# Altium project Soldeerbout.PrjPcb
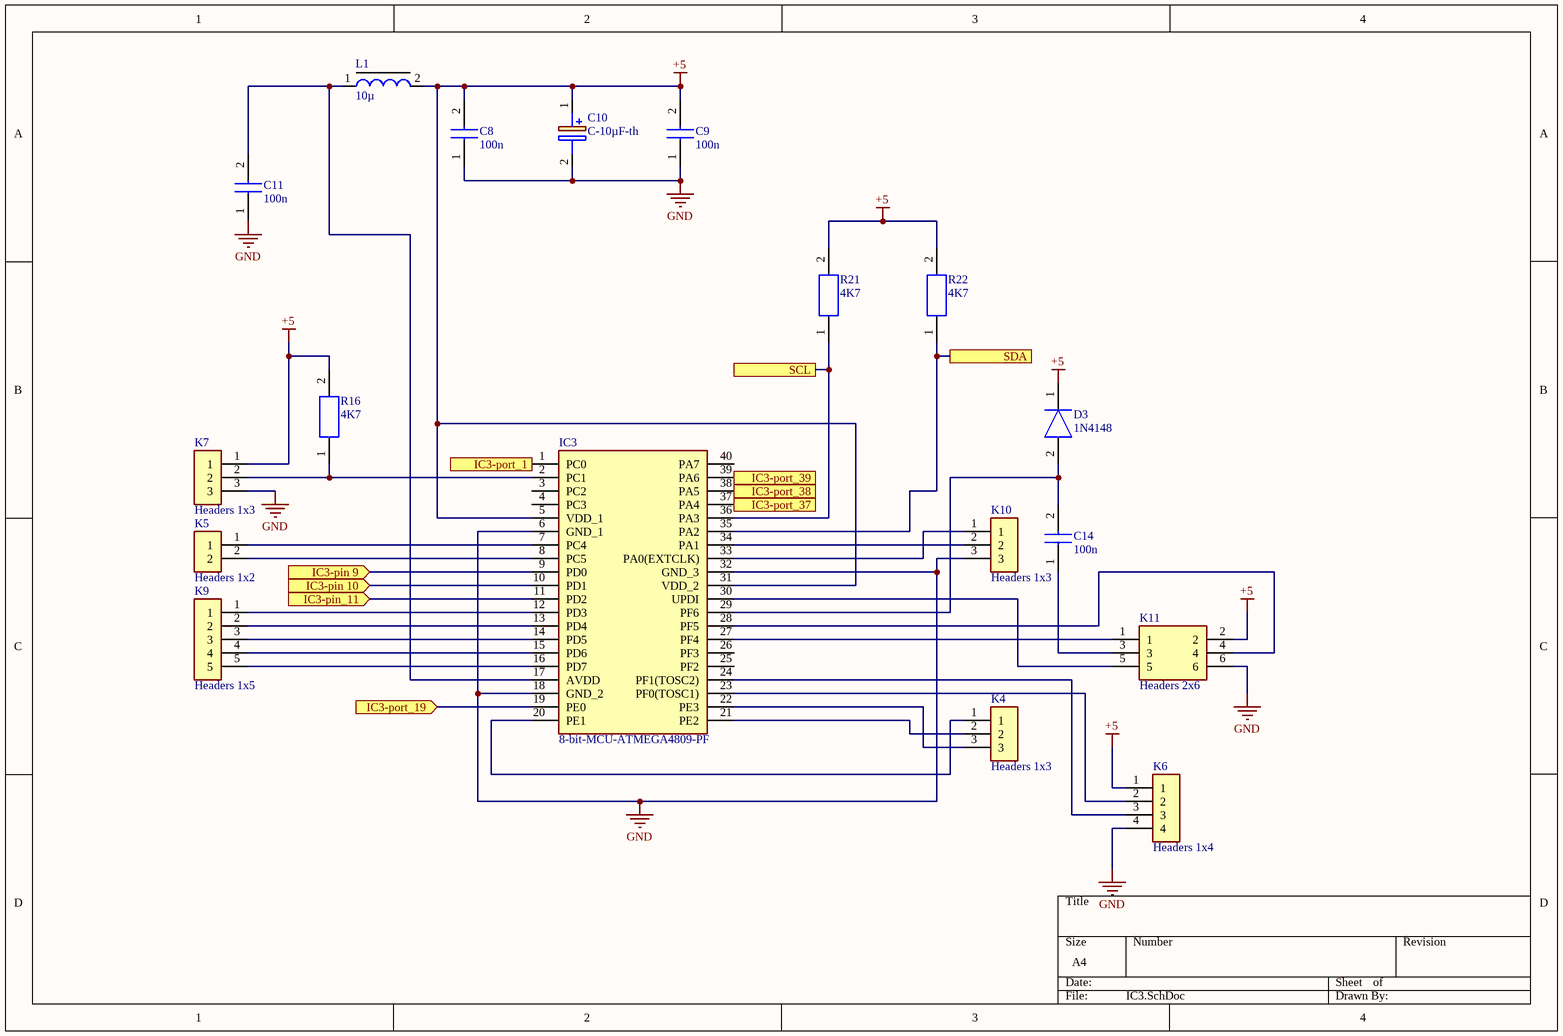
[diagram p0: IC3.SchDoc]
7 sheets, 78 parts. Net scope: flat (ports and power ports of the same name join across sheets).
Sheets:
  IC3.SchDoc
  Omvorming.SchDoc
  Opamps.SchDoc
  mosfet.SchDoc
  display.SchDoc
  encoder.SchDoc
  7-segment.SchDoc

## Sheet IC3.SchDoc
size A4; Engineer: Altium Designer; Organization: PXL; SheetNumber: 1; SheetTotal: 7

### Parts
C8  100n  [C-0805-smd]
C9  100n  [C-0805-smd]
C10  C-10µF-th  [C-10µF-th]
C11  100n  [C-0805-smd]
C14  100n  [C-0805-smd]
D3  1N4148  [1N4148]
IC3  8-bit-MCU-ATMEGA4809-PF  [8-bit-MCU-ATMEGA4809-PF]
K4  Headers 1x3  [Headers 1x3]
K5  Headers 1x2  [Headers 1x2]
K6  Headers 1x4  [Headers 1x4]
K7  Headers 1x3  [Headers 1x3]
K9  Headers 1x5  [Headers 1x5]
K10  Headers 1x3  [Headers 1x3]
K11  Headers 2x6  [Headers 2x6]
L1  10µ  [Smorespoel-10µH-130mA]
R16  4K7  [R-0805]
R21  4K7  [R-0805]
R22  4K7  [R-0805]

### Ports
IC3-pin 9 (in), IC3-pin 10 (in), IC3-pin_11 (in), IC3-port_1, IC3-port_19 (in), IC3-port_37, IC3-port_38, IC3-port_39, SCL, SDA

### Nets
+5: C8.2 C9.2 C10.1(+) D3.1(K) IC3.5(VDD_1) IC3.31(VDD_2) K6.1 K7.1 K11.2 L1.2 R16.2 R21.2 R22.2
GND: C8.1 C9.1 C10.2(-) C11.1 IC3.6(GND_1) IC3.18(GND_2) IC3.32(GND_3) K6.4 K7.3 K10.3 K11.6
NetC03_1: IC3.38(PA5) ; port IC3-port_38
NetC04_1: IC3.39(PA6) ; port IC3-port_39
NetC05_1: IC3.37(PA4) ; port IC3-port_37
NetC6_2: IC3.9(PD0) ; port IC3-pin 9
NetC11_2: C11.2 IC3.17(AVDD) L1.1
NetC12_2: IC3.10(PD1) ; port IC3-pin 10
NetC14_1: C14.1 K11.3
NetC14_2: C14.2 D3.2(A) IC3.29(PF6)
NetD2_1: IC3.11(PD2) ; port IC3-pin_11
NetIC3_1: IC3.1(PC0) ; port IC3-port_1
NetIC3_2: IC3.2(PC1) K7.2 R16.1
NetIC3_7: IC3.7(PC4) K5.1
NetIC3_8: IC3.8(PC5) K5.2
NetIC3_12: IC3.12(PD3) K9.1
NetIC3_13: IC3.13(PD4) K9.2
NetIC3_14: IC3.14(PD5) K9.3
NetIC3_15: IC3.15(PD6) K9.4
NetIC3_16: IC3.16(PD7) K9.5
NetIC3_19: IC3.19(PE0) ; port IC3-port_19
NetIC3_20: IC3.20(PE1) K4.1
NetIC3_21: IC3.21(PE2) K4.2
NetIC3_22: IC3.22(PE3) K4.3
NetIC3_23: IC3.23(PF0(TOSC1)) K6.2
NetIC3_24: IC3.24(PF1(TOSC2)) K6.3
NetIC3_27: IC3.27(PF4) K11.1
NetIC3_28: IC3.28(PF5) K11.4
NetIC3_30: IC3.30(UPDI) K11.5
NetIC3_33: IC3.33(PA0(EXTCLK)) K10.1
NetIC3_34: IC3.34(PA1) K10.2
NetIC3_35: IC3.35(PA2) R22.1 ; port SDA
NetIC3_36: IC3.36(PA3) R21.1 ; port SCL

Not connected (* = marked no-connect by the designer): IC3 3(PC2) 4(PC3) 25(PF2) 26(PF3) 40(PA7)

### Library data of the parts
C8 C9 C11 C14 = C-0805-smd: Capacitor; Manufacturer_Name: Kemet; Manufacturer_Part_Number: C0805C301G5GACTU; Datasheet Link: https://connect.kemet.com:7667/gateway/IntelliData-ComponentDocumentation/1.0/download/specsheet/C0805C301G5GACTU; Height: 0.88mm
C10 = C-10µF-th: Capacitor Polarised; Manufacturer_Name: Panasonic; Manufacturer_Part_Number: ECA-1HM100I; Datasheet Link: https://componentsearchengine.com//ECA-1HM100I.pdf; Height: 12mm; Mouser2 Part Number: 667-ECA-1HM100I; Mouser2 Price/Stock: https://www.mouser.com/Search/Refine.aspx?Keyword=667-ECA-1HM100I
D3 = 1N4148: Diode; Manufacturer_Name: Nexperia; Datasheet Link: https://datasheet.datasheetarchive.com/originals/distributors/Datasheets-112/DSAP0040891.pdf; Manufacturer_Part_Number: 1N4148
IC3 = 8-bit-MCU-ATMEGA4809-PF: Integrated Circuit; Manufacturer_Name: Microchip; Datasheet Link: https://componentsearchengine.com//ATMEGA4809-PF.pdf; Height: 6.35mm; Mouser2 Part Number: 556-ATMEGA4809-PF; Mouser2 Price/Stock: https://www.mouser.com/Search/Refine.aspx?Keyword=556-ATMEGA4809-PF; Manufacturer_Part_Number: ATMEGA4809-PF
K4 K7 K10 = Headers 1x3: Connector; Manufacturer_Name: TE Connectivity; Manufacturer_Part_Number: 2-826646-0; Datasheet Link: https://componentsearchengine.com/Datasheets/1/2-826646-0.pdf; Height: 8.8mm
K5 = Headers 1x2: Connector; Manufacturer_Name: TE Connectivity; Manufacturer_Part_Number: 2-826646-0; Datasheet Link: https://componentsearchengine.com/Datasheets/1/2-826646-0.pdf; Height: 8.8mm
K6 = Headers 1x4: Connector; Manufacturer_Name: TE Connectivity; Manufacturer_Part_Number: 2-826646-0; Datasheet Link: https://componentsearchengine.com/Datasheets/1/2-826646-0.pdf; Height: 8.8mm
K9 = Headers 1x5: Connector; Manufacturer_Name: TE Connectivity; Manufacturer_Part_Number: 2-826646-0; Datasheet Link: https://componentsearchengine.com/Datasheets/1/2-826646-0.pdf; Height: 8.8mm
K11 = Headers 2x6: Connector; Manufacturer_Name: Harwin; Manufacturer_Part_Number: M20-9761042; Datasheet Link: https://componentsearchengine.com//M20-9761042.pdf; Height: 8.38mm; Mouser2 Part Number: 855-M20-9761042; Mouser2 Price/Stock: https://www.mouser.com/Search/Refine.aspx?Keyword=855-M20-9761042
L1 = Smorespoel-10µH-130mA: THT Common Mode Power Line Choke WE-CMB, L = 1.00 mH; Inductance: 1.00 mH; PackageDescription: THT Inductor, 4-Leads, Body 27.5 x 18.5 mm; PackageReference: WE-CMB-L; PackageVersion: 2004; ComponentLink2URL: http://www.we-online.de/katalog/media/pdf/744824101.pdf; ComponentLink2Description: Datasheet; ComponentLink1Description: Manufacturer Link; DatasheetVersion: ver 5, Oct-2004; ComponentLink1URL: http://www.we-online.com
R16 R21 R22 = R-0805: Resistor; Manufacturer_Name: Vishay; Manufacturer_Part_Number: TNPU0805500RAZEN00; Height: 0.55mm

## Sheet Omvorming.SchDoc
size A4; SheetNumber: 2; SheetTotal: 7
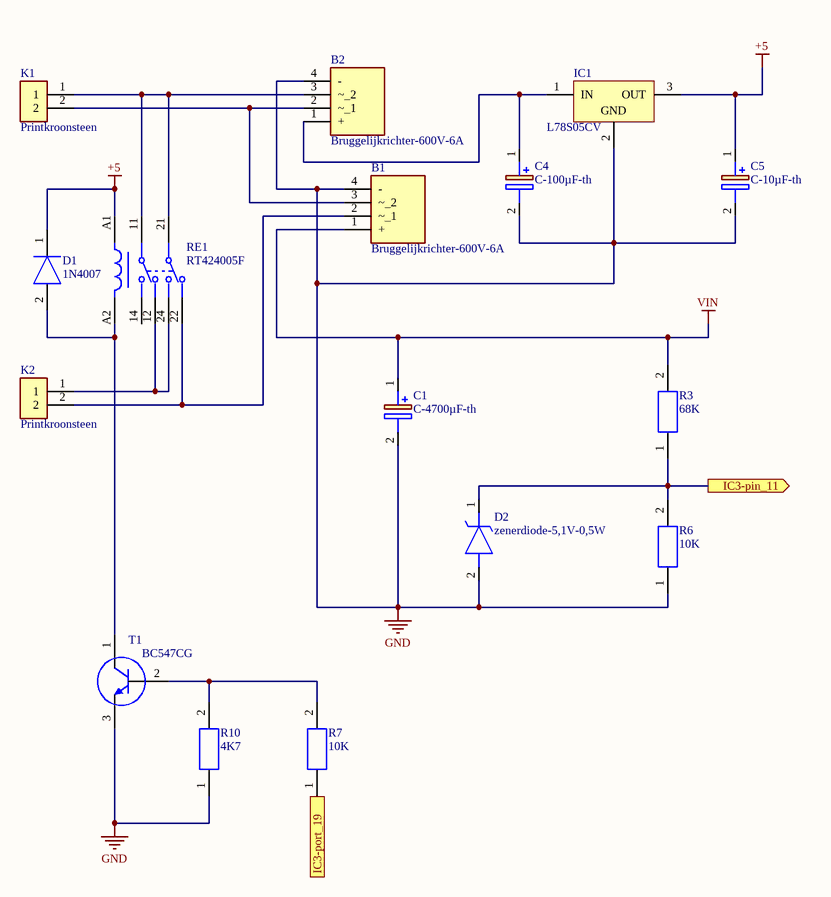
[diagram p1: Omvorming.SchDoc]

### Parts
B1  Bruggelijkrichter-600V-6A  [Bruggelijkrichter-600V-6A]
B2  Bruggelijkrichter-600V-6A  [Bruggelijkrichter-600V-6A]
C1  C-4700µF-th  [C-4700µF-th]
C4  C-100µF-th  [C-100µF-th]
C5  C-10µF-th  [C-10µF-th]
D1  1N4007  [1N4007]
D2  zenerdiode-5,1V-0,5W  [zenerdiode-5,1V-0,5W]
IC1  L78S05CV  [5V_Regulator-2A]
K1  Printkroonsteen  [Printkroonsteen]
K2  Printkroonsteen  [Printkroonsteen]
R3  68K  [R-0805]
R6  10K  [R-0805]
R7  10K  [R-0805]
R10  4K7  [R-0805]
RE1  RT424005F  [vermogenrelais-5VDC-8A]
T1  BC547CG  [BC547C]

### Ports
IC3-pin_11 (out), IC3-port_19 (out)

### Nets
+5: C5.1(+) D1.1(K) IC1.3(OUT) RE1.A1
GND: B1.4(-) B2.4(-) C1.2(-) C4.2(-) C5.2(-) D2.2(A) IC1.2(GND) R6.1 R10.1 T1.3(E)
VIN: B1.1(+) C1.1(+) R3.2
NetB1_2: B1.2(~_1) K2.2 RE1.22
NetB1_3: B1.3(~_2) B2.2(~_1) K1.2
NetB2_1: B2.1(+) C4.1(+) IC1.1(IN)
NetB2_3: B2.3(~_2) K1.1 RE1.11 RE1.21
NetD1_2: D1.2(A) RE1.A2 T1.1(C)
NetD2_1: D2.1(K) R3.1 R6.2 ; port IC3-pin_11
NetIC3_19: R7.1 ; port IC3-port_19
NetK2_1: K2.1 RE1.12 RE1.24
NetR7_2: R7.2 R10.2 T1.2(B)

Not connected (* = marked no-connect by the designer): RE1 14

### Library data of the parts
B1 B2 = Bruggelijkrichter-600V-6A: Bridge Rectifier; Manufacturer_Name: Vishay; Manufacturer_Part_Number: GBU6J-E3/45; Datasheet Link: http://www.vishay.com/docs/88615/gbu6a.pdf; Height: 18.8mm
C1 = C-4700µF-th: Capacitor Polarised; Manufacturer_Name: Kemet; Manufacturer_Part_Number: ESK478M050AQ3AA; Datasheet Link: https://componentsearchengine.com//ESK478M050AQ3AA.pdf; Height: 37mm; Mouser2 Part Number: 80-ESK478M050AQ3AA; Mouser2 Price/Stock: https://www.mouser.com/Search/Refine.aspx?Keyword=80-ESK478M050AQ3AA
C4 = C-100µF-th: Capacitor Polarised; Manufacturer_Name: Kemet; Manufacturer_Part_Number: ESK107M050AG3EA; Height: 12.5mm
C5 = C-10µF-th: as C10 on sheet IC3; Datasheet Link: https://componentsearchengine.com//ECA-1HM100I.pdf; Height: 12mm; Mouser2 Part Number: 667-ECA-1HM100I; Mouser2 Price/Stock: https://www.mouser.com/Search/Refine.aspx?Keyword=667-ECA-1HM100I
D1 = 1N4007: Diode; Manufacturer_Name: Rectron; Manufacturer_Part_Number: 1N4007-T; Datasheet Link: https://componentsearchengine.com//1N4007-T.pdf; Mouser2 Part Number: 583-1N4007-T; Mouser2 Price/Stock: https://www.mouser.com/Search/Refine.aspx?Keyword=583-1N4007-T
D2 = zenerdiode-5,1V-0,5W: Zener Diode; Manufacturer_Name: ON Semiconductor; Manufacturer_Part_Number: MM5Z4689T1G; Datasheet Link: https://www.mouser.in/datasheet/2/308/1/MM5Z4678T1_D-2315920.pdf; Height: 0.7mm
IC1 = 5V_Regulator-2A: 2A Positive Voltage Regulator, 5V, 3-Pin TO-220; PackageVersion: ver3.0; ComponentLink2URL: http://www.st.com/internet/com/TECHNICAL_RESOURCES/TECHNICAL_LITERATURE/DATASHEET/CD00000449.pdf; ComponentLink1Description: Manufacturer URL; DatasheetVersion: 1/03/2010; PackageDescription: TO, Thru-Hole, Vertical, Heatsink Mounted; 3 In-Line Leads; Pitch 2.54 mm; ComponentLink2Description: Datasheet; ComponentLink1URL: http://www.st.com; ComponentLink3Description: Package Specification; PackageReference: TO220; ComponentLink3URL: http://www.st.com/internet/com/TECHNICAL_RESOURCES/TECHNICAL_LITERATURE/PACKAGE_INFORMATION/CD00004649.pdf
K1 K2 = Printkroonsteen: Connector; Manufacturer_Name: CUI Inc.; Manufacturer_Part_Number: TB007-508-02BE; Datasheet Link: https://componentsearchengine.com//TB007-508-02BE.pdf; Height: 14mm; Mouser2 Part Number: 490-TB007-508-02BE; Mouser2 Price/Stock: https://www.mouser.com/Search/Refine.aspx?Keyword=490-TB007-508-02BE
R3 R6 R7 R10 = R-0805: as R16 on sheet IC3; Height: 0.55mm
RE1 = vermogenrelais-5VDC-8A: RELAY GENERAL PURPOSE DPDT 8A 5V; Power Consumption: 400mW; Coil Current: 80.6mA; Max Voltage Rating (AC): 400V; Coil Power: 500mW; Dropout Voltage: 500mV; Operate Time: 7ms; Contact Voltage Rating (AC): 250V; Coil Type: Non-Latching; Coil Resistance: 62R; Release Time: 3ms; Max Operating Temperature: 85°C; Package Quantity: 5000; Relay Type: General Purpose; Series: RT2; Lead Free: Lead Free; Coil Voltage (DC): 5V; Contact Current Rating: 8A; Packaging: Carton; Height: 15.7mm; Mount: Through Hole; Width: 12.7mm; ELV: Compliant; Termination: PCB; Contact Material: Silver; Throw Configuration: DPDT; Min Operating Temperature: -40°C; Weight: 13g; RoHS Compliant: Yes; Length: 29mm; Radiation Hardening: No
T1 = BC547C: Amplifier Transistor, NPN Silicon, 3-Pin TO-92, Pb-Free, Bulk Box; Manufacturer: On Semiconductor; IC Continuous (A): 0.1; fT Min (MHz): 150; ComponentLink3URL: http://www.onsemi.cn/pub_link/Collateral/2N6426-D.PDF; Mounting Technology: Through Hole; PackageReference: TO-92-3-29-11_AM_SL; ComponentLink2Description: Datasheet; RoHS: TRUE; Packing: Bulk Box; ComponentLink1Description: Manufacturer URL; PackageDescription: 3-Pin Transistor Outline, Body 4.825 x 3.685 mm, Pitch 1.27 mm; PackageVersion: Rev. AM; ComponentLink2URL: http://www.onsemi.com/pub_link/Collateral/BC546-D.PDF; ComponentLink3Description: Package Specification; ComponentLink1URL: http://www.onsemi.com/; DatasheetVersion: Rev. 7; Polarity: NPN; PartNumber: BC547CG

## Sheet Opamps.SchDoc
size A4; SheetNumber: 3; SheetTotal: 7
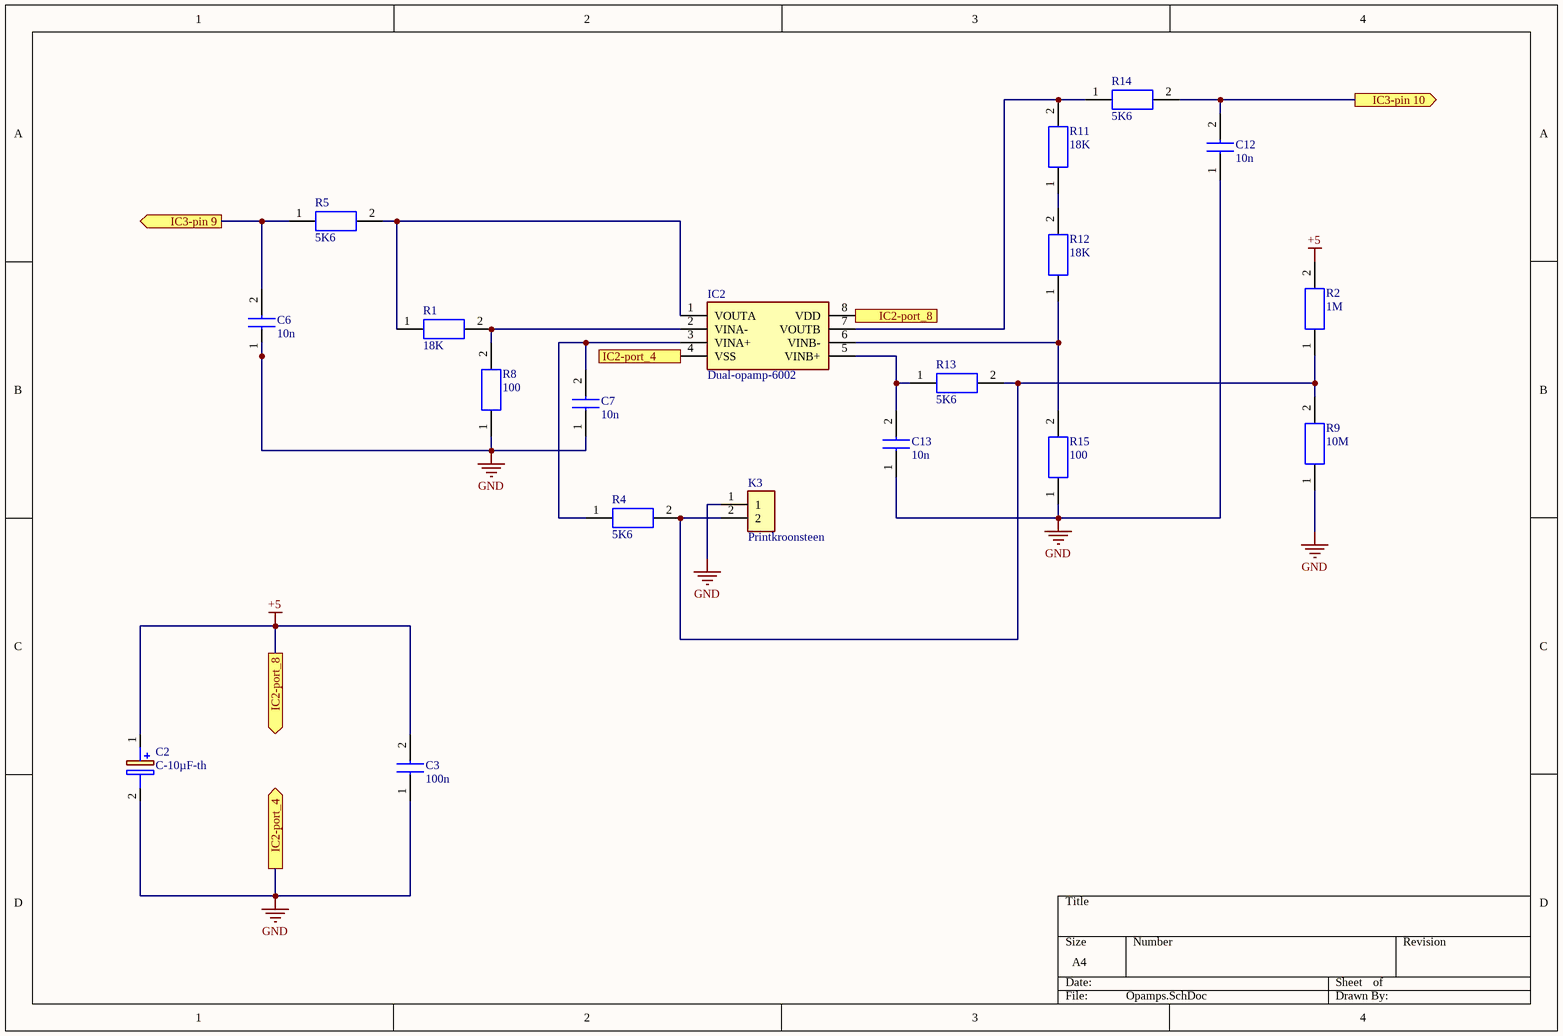
[diagram p2: Opamps.SchDoc]

### Parts
C2  C-10µF-th  [C-10µF-th]
C3  100n  [C-0805-smd]
C6  10n  [C-0805-smd]
C7  10n  [C-0805-smd]
C12  10n  [C-0805-smd]
C13  10n  [C-0805-smd]
IC2  Dual-opamp-6002  [Dual-opamp-6002]
K3  Printkroonsteen  [Printkroonsteen]
R1  18K  [R-0805]
R2  1M  [R-0805]
R4  5K6  [R-0805]
R5  5K6  [R-0805]
R8  100  [R-0805]
R9  10M  [R-0805]
R11  18K  [R-0805]
R12  18K  [R-0805]
R13  5K6  [R-0805]
R14  5K6  [R-0805]
R15  100  [R-0805]

### Ports
IC2-port_4 (in), IC2-port_4 (out), IC2-port_8 (in), IC2-port_8 (out), IC3-pin 9 (out), IC3-pin 10 (out)

### Nets
+5: C2.1(+) C3.2 IC2.8(VDD) R2.2 ; port IC2-port_8
GND: C2.2(-) C3.1 C6.1 C7.1 C12.1 C13.1 IC2.4(VSS) K3.1 R8.1 R9.1 R15.1 ; port IC2-port_4
NetC6_2: C6.2 R5.1 ; port IC3-pin 9
NetC7_2: C7.2 IC2.3(VINA+) R4.1
NetC12_2: C12.2 R14.2 ; port IC3-pin 10
NetC13_2: C13.2 IC2.5(VINB+) R13.1
NetIC2_1: IC2.1(VOUTA) R1.1 R5.2
NetIC2_2: IC2.2(VINA-) R1.2 R8.2
NetIC2_6: IC2.6(VINB-) R12.1 R15.2
NetIC2_7: IC2.7(VOUTB) R11.2 R14.1
NetK3_2: K3.2 R2.1 R4.2 R9.2 R13.2
NetR11_1: R11.1 R12.2

### Library data of the parts
C2 = C-10µF-th: as C10 on sheet IC3; Datasheet Link: https://componentsearchengine.com//ECA-1HM100I.pdf; Height: 12mm; Mouser2 Part Number: 667-ECA-1HM100I; Mouser2 Price/Stock: https://www.mouser.com/Search/Refine.aspx?Keyword=667-ECA-1HM100I
C3 C6 C7 C12 C13 = C-0805-smd: as C8 on sheet IC3; Datasheet Link: https://connect.kemet.com:7667/gateway/IntelliData-ComponentDocumentation/1.0/download/specsheet/C0805C301G5GACTU; Height: 0.88mm
IC2 = Dual-opamp-6002: Integrated Circuit; Manufacturer_Name: Microchip; Manufacturer_Part_Number: MCP6002-E/P; Datasheet Link: https://componentsearchengine.com//MCP6002-E_P.pdf; Height: 5.334mm; Mouser2 Part Number: 579-MCP6002-E/P; Mouser2 Price/Stock: https://www.mouser.com/Search/Refine.aspx?Keyword=579-MCP6002-E%2FP
K3 = Printkroonsteen: as K1 on sheet Omvorming; Datasheet Link: https://componentsearchengine.com//TB007-508-02BE.pdf; Height: 14mm; Mouser2 Part Number: 490-TB007-508-02BE; Mouser2 Price/Stock: https://www.mouser.com/Search/Refine.aspx?Keyword=490-TB007-508-02BE
R1 R2 R4 R5 R8 R9 R11-R15 = R-0805: as R16 on sheet IC3; Height: 0.55mm

## Sheet mosfet.SchDoc
size A4; SheetNumber: 4; SheetTotal: 7
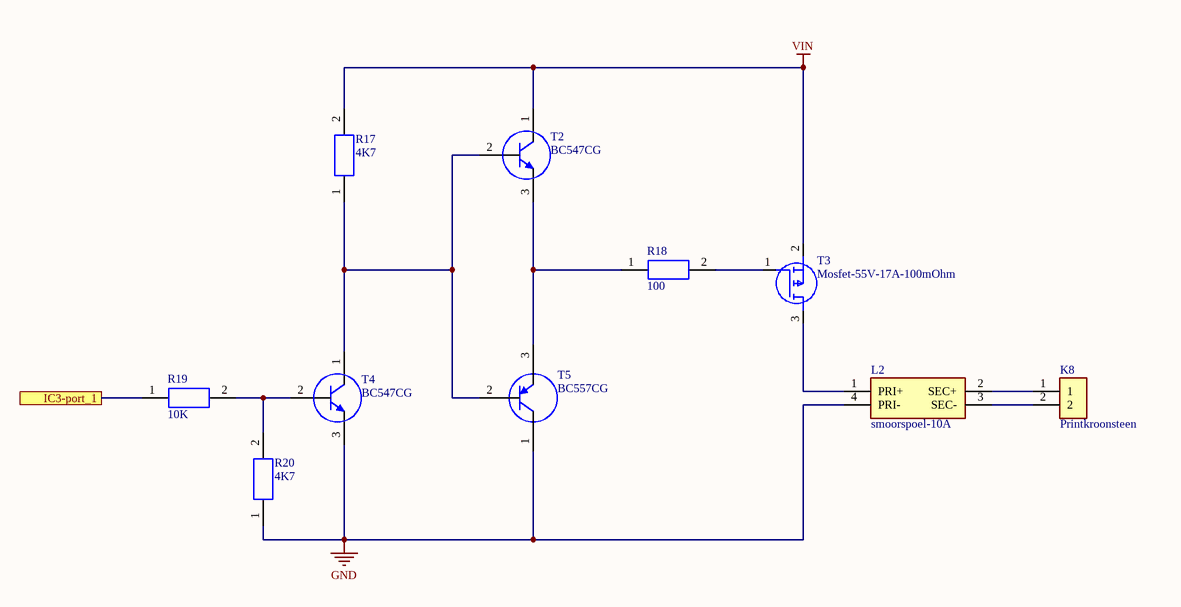
[diagram p3: mosfet.SchDoc]

### Parts
K8  Printkroonsteen  [Printkroonsteen]
L2  smoorspoel-10A  [smoorspoel-10A]
R17  4K7  [R-0805]
R18  100  [R-0805]
R19  10K  [R-0805]
R20  4K7  [R-0805]
T2  BC547CG  [BC547C]
T3  Mosfet-55V-17A-100mOhm  [Mosfet-55V-17A-100mOhm]
T4  BC547CG  [BC547C]
T5  BC557CG  [BC557C]

### Ports
IC3-port_1

### Nets
GND: L2.4(PRI-) R20.1 T4.3(E) T5.1(C)
VIN: R17.2 T2.1(C) T3.2(S)
NetIC3_1: R19.1 ; port IC3-port_1
NetK8_1: K8.1 L2.2(SEC+)
NetK8_2: K8.2 L2.3(SEC-)
NetL2_1: L2.1(PRI+) T3.3(D)
NetR17_1: R17.1 T2.2(B) T4.1(C) T5.2(B)
NetR18_1: R18.1 T2.3(E) T5.3(E)
NetR18_2: R18.2 T3.1(G)
NetR19_2: R19.2 R20.2 T4.2(B)

### Library data of the parts
K8 = Printkroonsteen: as K1 on sheet Omvorming; Datasheet Link: https://componentsearchengine.com//TB007-508-02BE.pdf; Height: 14mm; Mouser2 Part Number: 490-TB007-508-02BE; Mouser2 Price/Stock: https://www.mouser.com/Search/Refine.aspx?Keyword=490-TB007-508-02BE
L2 = smoorspoel-10A: Transformer; Manufacturer_Name: Laird Technologies; Manufacturer_Part_Number: CM2545X171B-10; Datasheet Link: https://datasheet.datasheetarchive.com/originals/dk/DKDS-7/122753.pdf; Height: 9.5mm
R17-R20 = R-0805: as R16 on sheet IC3; Height: 0.55mm
T2 T4 = BC547C: as T1 on sheet Omvorming; ComponentLink3URL: http://www.onsemi.cn/pub_link/Collateral/2N6426-D.PDF; Mounting Technology: Through Hole; PackageReference: TO-92-3-29-11_AM_SL; ComponentLink2Description: Datasheet; RoHS: TRUE; Packing: Bulk Box; ComponentLink1Description: Manufacturer URL; PackageDescription: 3-Pin Transistor Outline, Body 4.825 x 3.685 mm, Pitch 1.27 mm; PackageVersion: Rev. AM; ComponentLink2URL: http://www.onsemi.com/pub_link/Collateral/BC546-D.PDF; ComponentLink3Description: Package Specification; ComponentLink1URL: http://www.onsemi.com/; DatasheetVersion: Rev. 7; Polarity: NPN; PartNumber: BC547CG
T3 = Mosfet-55V-17A-100mOhm: MOSFET (P-Channel); Manufacturer_Name: Infineon; Manufacturer_Part_Number: IRF9Z34NPBF; Datasheet Link: https://componentsearchengine.com//IRF9Z34NPBF.pdf; Height: 4.69mm; Mouser2 Part Number: 942-IRF9Z34NPBF; Mouser2 Price/Stock: https://www.mouser.com/Search/Refine.aspx?Keyword=942-IRF9Z34NPBF
T5 = BC557C: Amplifier Transistor, PNP Silicon, 3-Pin TO-92, Pb-Free, Bulk Box; Manufacturer: On Semiconductor; IC Continuous (A): -0.1; RoHS: TRUE; DatasheetVersion: Rev. 3; ComponentLink2Description: Datasheet; Packing: Bulk Box; PackageReference: TO-92-3-29-11_AM_SL; ComponentLink3URL: http://www.onsemi.cn/pub_link/Collateral/2N6426-D.PDF; ComponentLink2URL: http://www.onsemi.com/pub_link/Collateral/BC556B-D.PDF; PartNumber: BC557CG; PackageDescription: 3-Pin Transistor Outline, Body 4.825 x 3.685 mm, Pitch 1.27 mm; PackageVersion: Rev. AM; ComponentLink3Description: Package Specification; ComponentLink1URL: http://www.onsemi.com/; ComponentLink1Description: Manufacturer URL; Polarity: PNP; Mounting Technology: Through Hole

## Sheet display.SchDoc
size A4; SheetNumber: 5; SheetTotal: 7
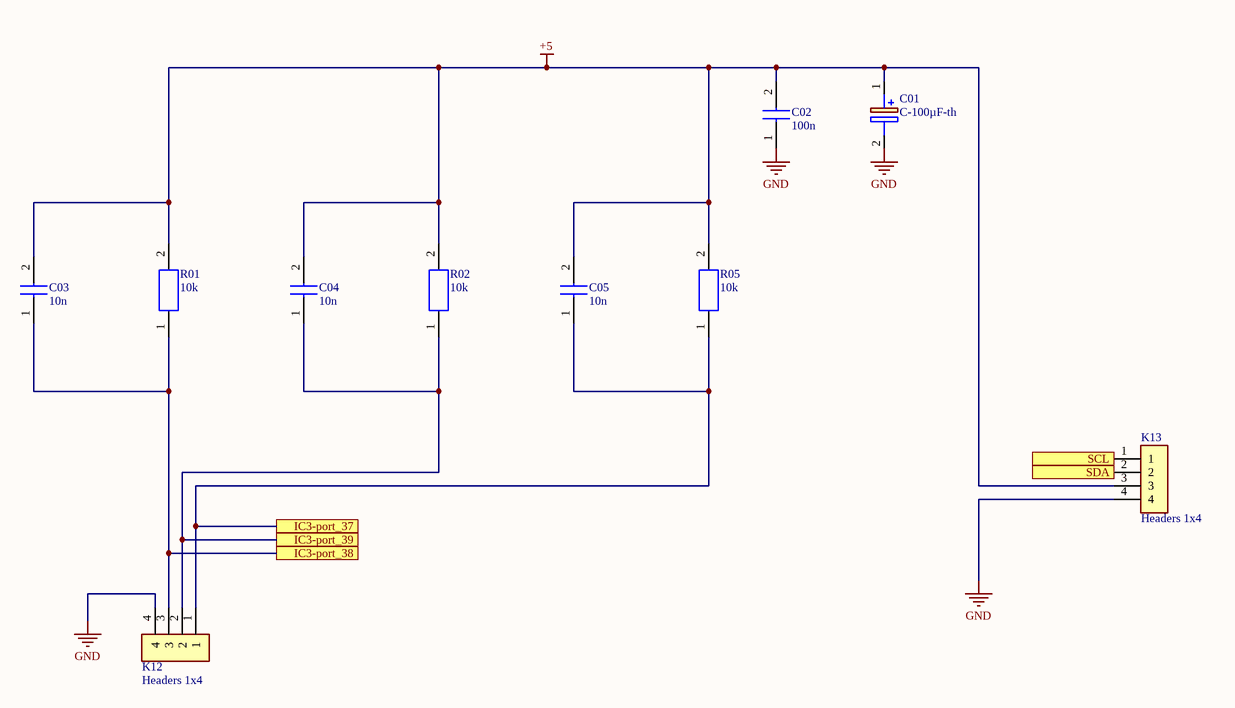
[diagram p4: display.SchDoc]

### Parts
C01  C-100µF-th  [C-100µF-th]
C02  100n  [C-0805-smd]
C03  10n  [C-0805-smd]
C04  10n  [C-0805-smd]
C05  10n  [C-0805-smd]
K12  Headers 1x4  [Headers 1x4]
K13  Headers 1x4  [Headers 1x4]
R01  10k  [R-0805]
R02  10k  [R-0805]
R05  10k  [R-0805]

### Ports
IC3-port_37, IC3-port_38, IC3-port_39, SCL, SDA

### Nets
+5: C01.1(+) C02.2 C03.2 C04.2 C05.2 K13.3 R01.2 R02.2 R05.2
GND: C01.2(-) C02.1 K12.4 K13.4
NetC03_1: C03.1 K12.3 R01.1 ; port IC3-port_38
NetC04_1: C04.1 K12.2 R02.1 ; port IC3-port_39
NetC05_1: C05.1 K12.1 R05.1 ; port IC3-port_37
NetIC3_35: K13.2 ; port SDA
NetIC3_36: K13.1 ; port SCL

### Library data of the parts
C01 = C-100µF-th: as C4 on sheet Omvorming; Height: 12.5mm
C02 C03 C04 C05 = C-0805-smd: as C8 on sheet IC3; Datasheet Link: https://connect.kemet.com:7667/gateway/IntelliData-ComponentDocumentation/1.0/download/specsheet/C0805C301G5GACTU; Height: 0.88mm
K12 K13 = Headers 1x4: as K6 on sheet IC3; Datasheet Link: https://componentsearchengine.com/Datasheets/1/2-826646-0.pdf; Height: 8.8mm
R01 R02 R05 = R-0805: as R16 on sheet IC3; Height: 0.55mm

## Sheet encoder.SchDoc
size A4; SheetNumber: 6; SheetTotal: 7
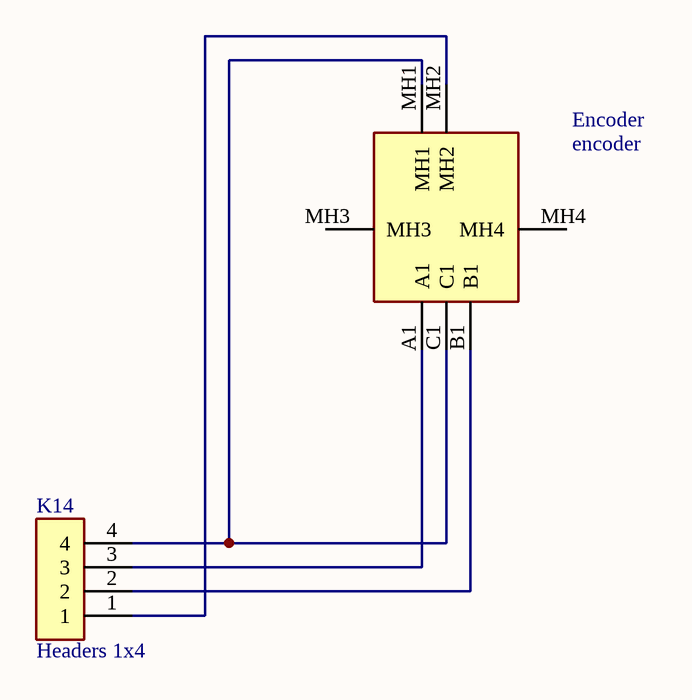
[diagram p5: encoder.SchDoc]

### Parts
Encoder  encoder  [encoder]
K14  Headers 1x4  [Headers 1x4]

### Nets
NetEncoder_A1: Encoder.A1 K14.3
NetEncoder_B1: Encoder.B1 K14.2
NetEncoder_C1: Encoder.C1 Encoder.MH1 K14.4
NetEncoder_MH2: Encoder.MH2 K14.1

Not connected (* = marked no-connect by the designer): Encoder MH3 MH4

### Library data of the parts
Encoder = encoder: Undefined or Miscellaneous; Manufacturer_Name: Alpha (Taiwan); Manufacturer_Part_Number: RE130F-41-175F-12P; Datasheet Link: https://componentsearchengine.com//RE130F-41-175F-12P.pdf; Height: 17.5mm; Mouser2 Part Number: 318-ENC130175F-12PS; Mouser2 Price/Stock: https://www.mouser.com/Search/Refine.aspx?Keyword=318-ENC130175F-12PS
K14 = Headers 1x4: as K6 on sheet IC3; Datasheet Link: https://componentsearchengine.com/Datasheets/1/2-826646-0.pdf; Height: 8.8mm

## Sheet 7-segment.SchDoc
size A4; SheetNumber: 7; SheetTotal: 7
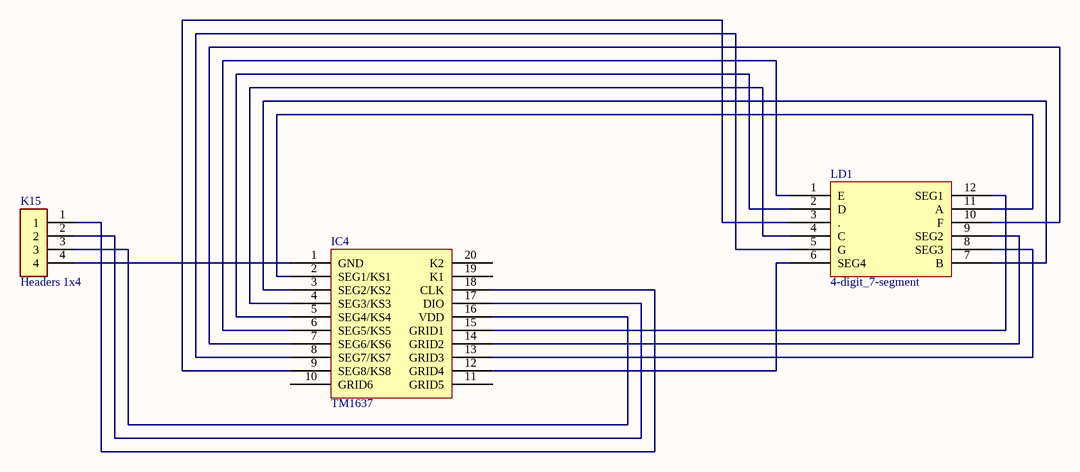
[diagram p6: 7-segment.SchDoc]

### Parts
IC4  TM1637  [TM1637]
K15  Headers 1x4  [Headers 1x4]
LD1  4-digit_7-segment  [4-digit_7-segment]

### Nets
NetIC4_1: IC4.1(GND) K15.4
NetIC4_2: IC4.2(SEG1/KS1) LD1.11(A)
NetIC4_3: IC4.3(SEG2/KS2) LD1.7(B)
NetIC4_4: IC4.4(SEG3/KS3) LD1.4(C)
NetIC4_5: IC4.5(SEG4/KS4) LD1.2(D)
NetIC4_6: IC4.6(SEG5/KS5) LD1.1(E)
NetIC4_7: IC4.7(SEG6/KS6) LD1.10(F)
NetIC4_8: IC4.8(SEG7/KS7) LD1.5(G)
NetIC4_9: IC4.9(SEG8/KS8) LD1.3(.)
NetIC4_12: IC4.12(GRID4) LD1.6(SEG4)
NetIC4_13: IC4.13(GRID3) LD1.8(SEG3)
NetIC4_14: IC4.14(GRID2) LD1.9(SEG2)
NetIC4_15: IC4.15(GRID1) LD1.12(SEG1)
NetIC4_16: IC4.16(VDD) K15.3
NetIC4_17: IC4.17(DIO) K15.2
NetIC4_18: IC4.18(CLK) K15.1

Not connected (* = marked no-connect by the designer): IC4 10(GRID6) 11(GRID5) 19(K1) 20(K2)

### Library data of the parts
IC4 = TM1637: Led Drive Control Special Circuit
K15 = Headers 1x4: as K6 on sheet IC3; Datasheet Link: https://componentsearchengine.com/Datasheets/1/2-826646-0.pdf; Height: 8.8mm

## Nets that join several sheets
+5: IC3 (13 pins), Omvorming (C5.1 D1.1 IC1.3 RE1.A1), Opamps (C2.1 C3.2 IC2.8 R2.2), display (9 pins)
GND: IC3 (11 pins), Omvorming (10 pins), Opamps (11 pins), mosfet (L2.4 R20.1 T4.3 T5.1), display (C01.2 C02.1 K12.4 K13.4)
VIN: Omvorming (B1.1 C1.1 R3.2), mosfet (R17.2 T2.1 T3.2)
NetC03_1: IC3 (IC3.38), display (C03.1 K12.3 R01.1)
NetC04_1: IC3 (IC3.39), display (C04.1 K12.2 R02.1)
NetC05_1: IC3 (IC3.37), display (C05.1 K12.1 R05.1)
NetC6_2: IC3 (IC3.9), Opamps (C6.2 R5.1)
NetC12_2: IC3 (IC3.10), Opamps (C12.2 R14.2)
NetD2_1: IC3 (IC3.11), Omvorming (D2.1 R3.1 R6.2)
NetIC3_1: IC3 (IC3.1), mosfet (R19.1)
NetIC3_19: IC3 (IC3.19), Omvorming (R7.1)
NetIC3_35: IC3 (IC3.35 R22.1), display (K13.2)
NetIC3_36: IC3 (IC3.36 R21.1), display (K13.1)